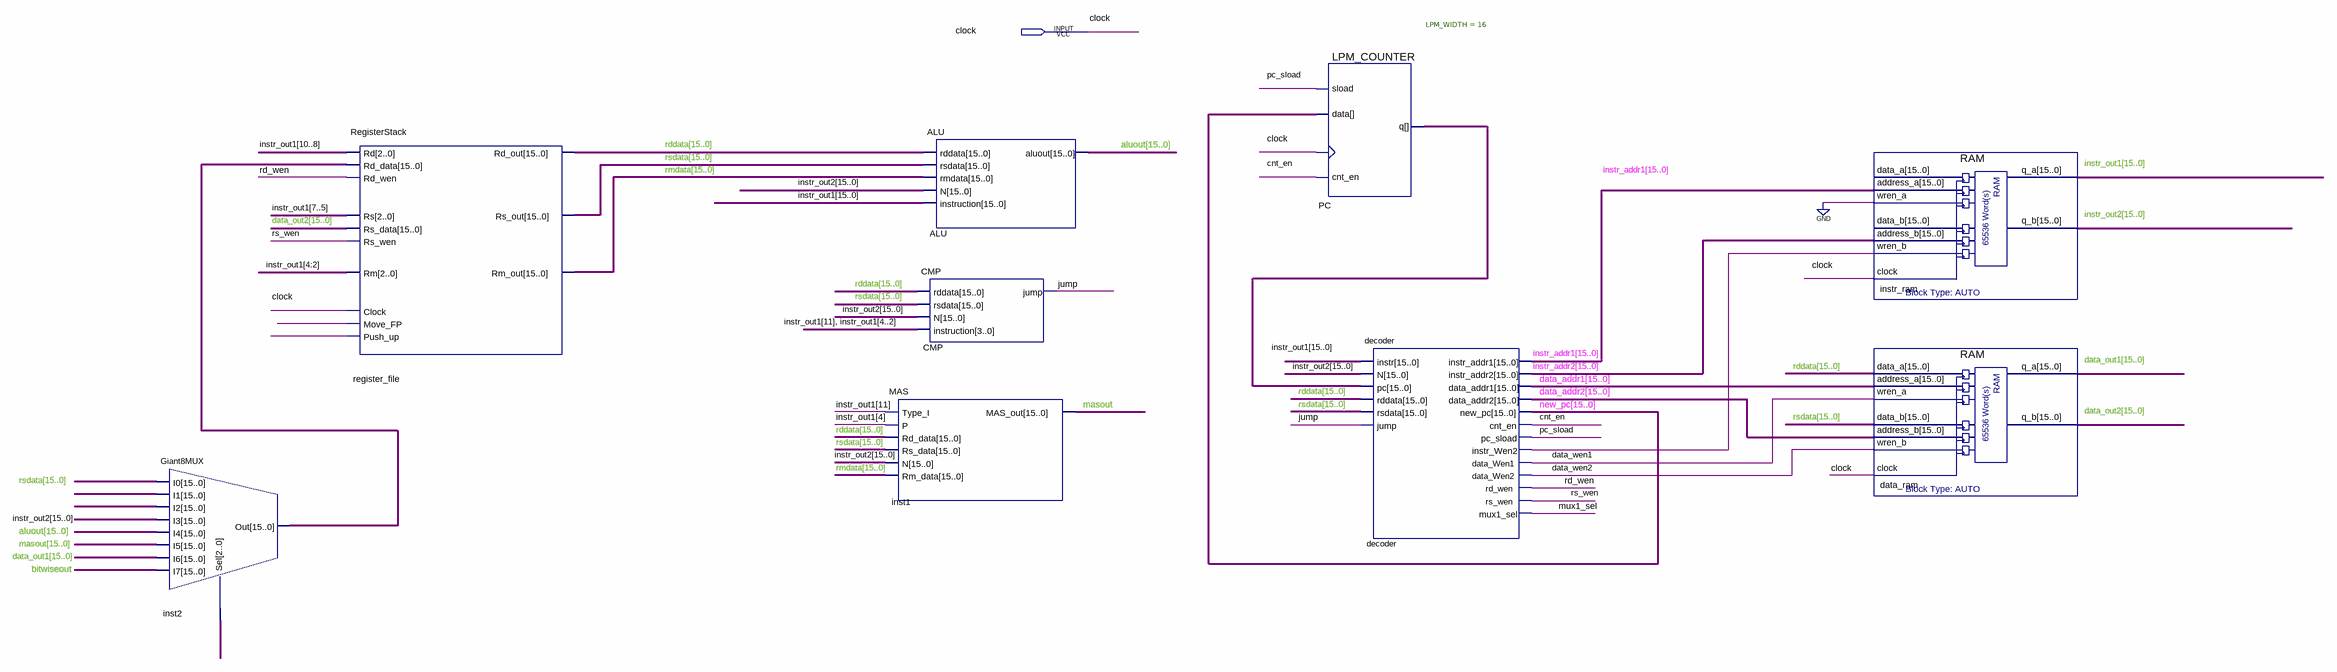
[diagram p0: schematic sheet]
// Quartus schematic Main CPU.bdf as structural Verilog: 9 symbols, 1 pins
module \Main_CPU  (
  input  clock
);

  wire bitwiseout, cnt_en, data_wen1, data_wen2, decoder_instr_wen2, jump, masout_1bit, mux1_sel, pc_sload,
       rd_wen, rs_wen, undriven, undriven_2;
  wire [2:0] undriven_5;
  wire [15:0] aluout, data_addr1, data_addr2, data_out1, data_out2, inst2_out, instr_addr1, instr_addr2,
       instr_out1, instr_out2, masout, new_pc, PC_q, rddata, rmdata, rsdata, undriven_3, undriven_4;

  Giant8MUX inst2 (
    .I0(rsdata), .I1(undriven_3), .I2(undriven_4), .I3(instr_out2), .I4(aluout), .I5(masout), .I6(data_out1),
    .I7({16{bitwiseout}}), .Sel(undriven_5), .Out(inst2_out));
  RegisterStack register_file (
    .Clock(clock), .Move_FP(undriven), .Rd_wen(rd_wen), .Rd(instr_out1[10:8]), .Rs_wen(rs_wen),
    .Rd_data(inst2_out), .Rs_data(data_out2), .Rs(instr_out1[7:5]), .Push_up(undriven_2),
    .Rm(instr_out1[4:2]), .Rd_out(rddata), .Rs_out(rsdata), .Rm_out(rmdata));
  MAS inst1 (
    .Type_I(instr_out1[11]), .P(instr_out1[4]), .Rd_data(rddata), .Rs_data(rsdata), .N(instr_out2),
    .Rm_data(rmdata), .MAS_out(masout_1bit));
  ALU ALU (
    .rddata(rddata), .rsdata(rsdata), .rmdata(rmdata), .N(instr_out2), .instruction(instr_out1),
    .aluout(aluout));
  CMP CMP (
    .rddata(rddata), .rsdata(rsdata), .N(instr_out2), .instruction({instr_out1[11], instr_out1[4:2]}),
    .jump(jump));
  LPM_COUNTER #(.LPM_WIDTH(16)) PC (.sload(pc_sload), .data(new_pc), .clock(clock), .cnt_en(cnt_en), .q(PC_q));
  decoder decoder (
    .instr(instr_out1), .N(instr_out2), .pc(PC_q), .rddata(rddata), .rsdata(rsdata), .jump(jump),
    .instr_addr1(instr_addr1), .instr_addr2(instr_addr2), .data_addr1(data_addr1), .data_addr2(data_addr2),
    .new_pc(new_pc), .cnt_en(cnt_en), .pc_sload(pc_sload), .instr_Wen2(decoder_instr_wen2),
    .data_Wen1(data_wen1), .data_Wen2(data_wen2), .rd_wen(rd_wen), .rs_wen(rs_wen), .mux1_sel(mux1_sel));
  RAM instr_ram (
    .address_a(instr_addr1), .wren_a(1'b0), .address_b(instr_addr2), .wren_b(decoder_instr_wen2),
    .clock(clock), .q_a(instr_out1), .q_b(instr_out2));  // open: data_a, data_b
  RAM data_ram (
    .data_a(rddata), .address_a(data_addr1), .wren_a(data_wen1), .data_b(rsdata), .address_b(data_addr2),
    .wren_b(data_wen2), .clock(clock), .q_a(data_out1), .q_b(data_out2));
endmodule
